# Altium schematic sheet MohamedAazir_WirelessEMG__version_1.0_PCB__ESP.schdoc
size 276 x 197 mm
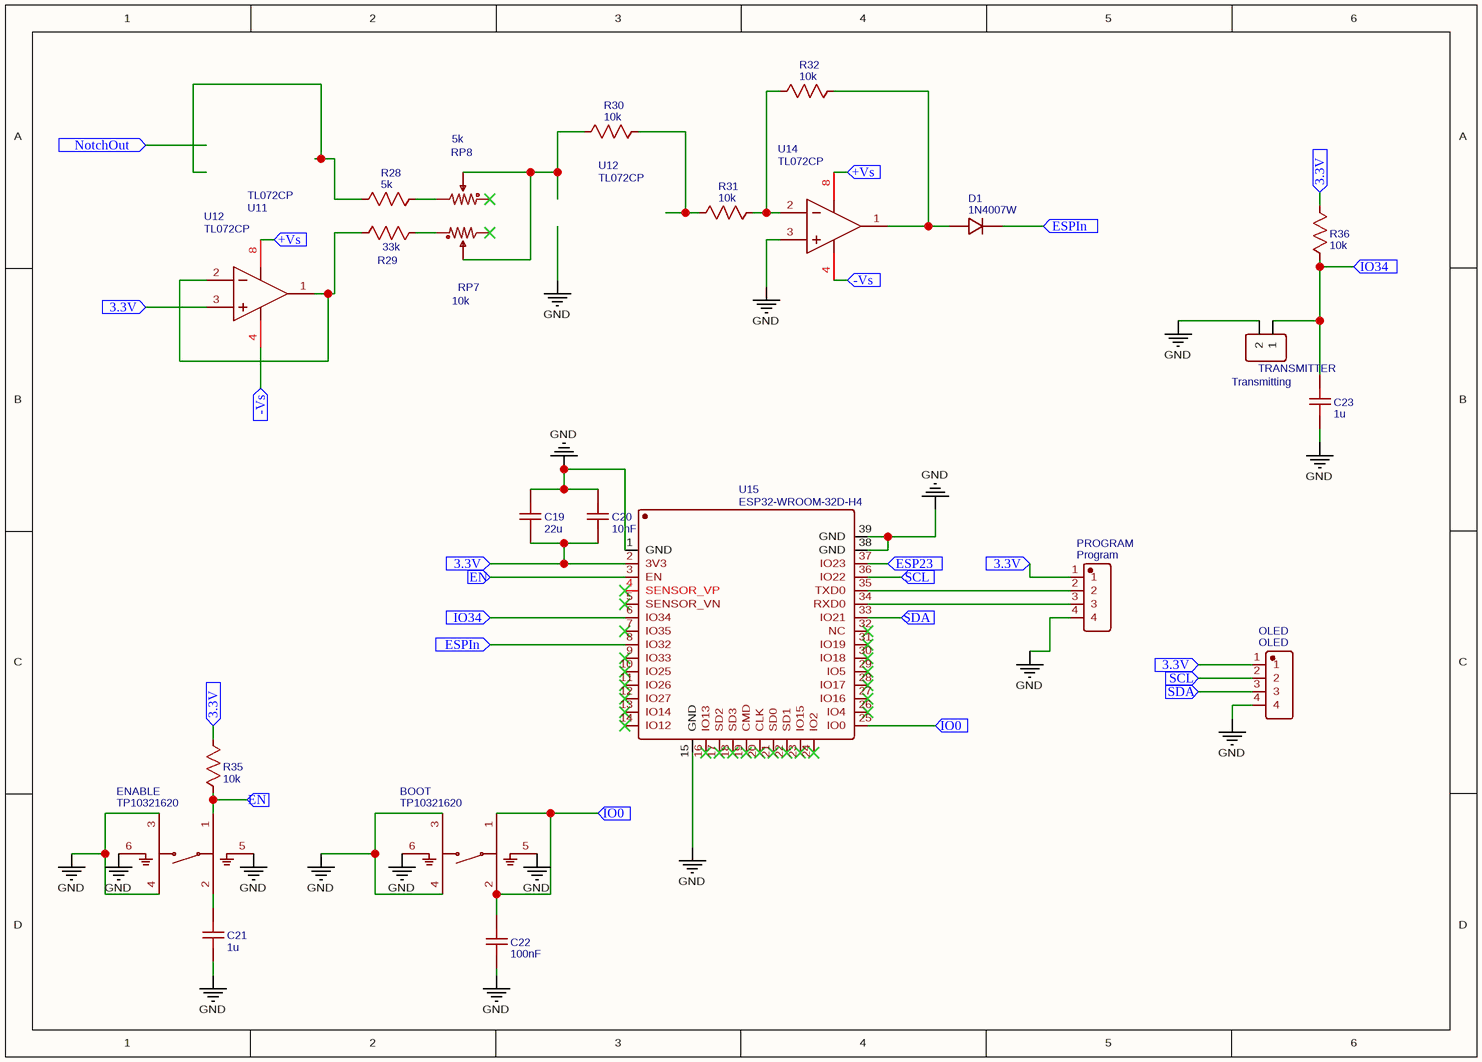
[diagram p0: MohamedAazir_WirelessEMG__version_1.0_PCB__ESP.schdoc]

## Parts
(Parts that share a designator on the sheet are numbered #1, #2 ... from top to bottom, then left to right.)
BOOT  TP10321620  [SW-SMD_ROCPUSWITCHES_TP1032]
C19  22u  [C0603]
C20  10nF  [C0603]
C21  1u  [C0603]
C22  100nF  [C0603]
C23  1u  [C0603]
D1  1N4007W  [SOD-123_L2.8-W1.8-LS3.7-RD]
ENABLE  TP10321620  [SW-SMD_ROCPUSWITCHES_TP1032]
OLED  OLED  [CONN-TH_4P-P4.00_FLY4-HEADER4]
PROGRAM  Program  [CONN-TH_4P-P4.00_FLY4-HEADER4]
R28  5k  [R0603]
R29  33k  [R0603]
R30  10k  [R0603]
R31  10k  [R0603]
R32  10k  [R0603]
R35  10k  [R0603]
R36  10k  [R0603]
RP7  10k  [RES-ADJ-TH_3386P]
RP8  5k  [RES-ADJ-TH_3386P]
TRANSMITTER  Transmitting  [HDR-F-2.54_1X2]
U11  TL072CP  [DIP-8_L9.6-W6.4-P2.54-LS7.6-BL-1]
U12#1  TL072CP  [DIP-8_L9.6-W6.4-P2.54-LS7.6-BL-1]
U12#2  TL072CP  [DIP-8_L9.6-W6.4-P2.54-LS7.6-BL-1]
U14  TL072CP  [DIP-8_L9.6-W6.4-P2.54-LS7.6-BL-1]
U15  ESP32-WROOM-32D-H4  [WIFIM-SMD_ESP32-WROOM-32D]

## Ports
3.3V (in), +Vs (in), -Vs (in), EN (in), ESP23 (in), ESPIn (in), IO0 (in), IO34 (in), NotchOut (in), SCL (in), SDA (in)

## Nets
GND: BOOT.3 BOOT.4 BOOT.5 BOOT.6 C19.1 C20.1 C21.1 C22.1 C23.1 ENABLE.3 ENABLE.4 ENABLE.5 ENABLE.6 OLED.4 PROGRAM.4 TRANSMITTER.2 U14.3(IN1+) U15.1(GND) U15.15(GND) U15.38(GND) U15.39(GND)
3.3V: C19.2 C20.2 OLED.1 PROGRAM.1 R35.2 R36.2 U12#2.3(IN1+) U15.2(3V3) ; port 3.3V
+Vs: U12#2.8(VCC+) U14.8(VCC+) ; port +Vs
-Vs: U12#2.4(VCC-) U14.4(VCC-) ; port -Vs
EN: ENABLE.1 R35.1 U15.3(EN) ; port EN
ESP23: U15.37(IO23) ; port ESP23
ESPIn: D1.1 U15.8(IO32) ; port ESPIn
IO0: BOOT.1 BOOT.2 C22.2 U15.25(IO0) ; port IO0
IO34: C23.2 R36.1 TRANSMITTER.1 U15.6(IO34) ; port IO34
SCL: OLED.2 U15.36(IO22) ; port SCL
SDA: OLED.3 U15.33(IO21) ; port SDA
NetC21_2: C21.2 ENABLE.2
NetD1_2: D1.2 R32.2 U14.1(OUT1)
NetPROGRAM_2: PROGRAM.2 U15.35(TXD0)
NetPROGRAM_3: PROGRAM.3 U15.34(RXD0)
NetR28_2: R28.2 RP7.3
NetR29_1: R29.1 U12#2.1(OUT1) U12#2.2(IN1-)
NetR29_2: R29.2 RP8.1
NetR30_1: R30.1 RP7.2 RP8.2
NetR30_2: R30.2 R31.1
NetR31_2: R31.2 R32.1 U14.2(IN1-)

Not connected (* = marked no-connect by the designer): R28 1; RP7 1*; RP8 3*; U15 4(SENSOR_VP)* 5(SENSOR_VN)* 7(IO35)* 9(IO33)* 10(IO25)* 11(IO26)* 12(IO27)* 13(IO14)* 14(IO12)* 16(IO13)* 17(SD2)* 18(SD3)* 19(CMD)* 20(CLK)* 21(SD0)* 22(SD1)* 23(IO15)* 24(IO2)* 26(IO4)* 27(IO16)* 28(IO17)* 29(IO5)* 30(IO18)* 31(IO19)* 32(NC)*

## Library data of the parts
BOOT ENABLE = TP10321620: Manufacturer: ROCPU Switches(台普); Contributor: lcsc; Supplier: LCSC; Supplier Part: C2999324; Manufacturer Part: TP10321620; JLCPCB Part Class: Extended Part; spicePre: U; spiceSymbolName: TP10321620
C19 = 22u: Manufacturer Part: 1206X226M250NT; Manufacturer: FH(风华); nameAlias: Value(F); Contributor: LCEDA_Lib; Supplier Part: C2858005; Supplier: LCSC; spicePre: C; spiceSymbolName: C_0603_US
C20 = 10nF: Manufacturer Part: C1608X8R1H103M080AA; Manufacturer: TDK; nameAlias: Value(F); Contributor: LCEDA_Lib; Supplier Part: C3901732; Supplier: LCSC; spicePre: C; spiceSymbolName: C_0603_US
C21 C23 = 1u: Manufacturer Part: T491B105M035AT; Manufacturer: KEMET(基美); nameAlias: Value(F); Contributor: LCEDA_Lib; Supplier Part: C600504; Supplier: LCSC; spicePre: C; spiceSymbolName: C_0603_US
C22 = 100nF: Manufacturer Part: CA45-A-35V-0.1UF-K; Manufacturer: CEC(振华新云); nameAlias: Value(F); Contributor: LCEDA_Lib; Supplier Part: C2976900; Supplier: LCSC; spicePre: C; spiceSymbolName: C_0603_US
D1 = 1N4007W: Manufacturer: BLUE ROCKET; Contributor: LCEDA_Lib; Supplier: LCSC; Supplier Part: C328592; Manufacturer Part: 1N4007W; spicePre: D; spiceSymbolName: 1N4007W
OLED = OLED: Manufacturer Part: FLY4-Header4; Contributor: LCSC; Supplier: LCSC; Supplier Part: C9900006105; JLCPCB Part Class: Extended Part; spicePre: C; spiceSymbolName: FLY4-HEADER4
PROGRAM = Program: Manufacturer Part: FLY4-Header4; Contributor: LCSC; Supplier: LCSC; Supplier Part: C9900006105; JLCPCB Part Class: Extended Part; spicePre: C; spiceSymbolName: FLY4-HEADER4
R28 = 5k: Manufacturer Part: TR0603B5K00P0525Z; Manufacturer: EVER OHMS(天二科技); nameAlias: Value(Ω); Contributor: LCEDA_Lib; Supplier Part: C3202451; Supplier: LCSC; spicePre: R; spiceSymbolName: R_0603_US
R29 = 33k: Manufacturer Part: MEV07V3302FE; Manufacturer: Ohmite; nameAlias: Value(Ω); Contributor: LCEDA_Lib; Supplier Part: C4216305; Supplier: LCSC; spicePre: R; spiceSymbolName: R_0603_US
R30-R32 R35 R36 = 10k: Manufacturer Part: CSR0204FTDV1002; Manufacturer: Viking(光颉); nameAlias: Value(Ω); Contributor: LCEDA_Lib; Supplier Part: C316475; Supplier: LCSC; spicePre: R; spiceSymbolName: R_0603_US
RP7 = 10k: Manufacturer Part: ST-4ETG 10K OHM (103); Manufacturer: NIDEC(尼得科); nameAlias: Value; Contributor: LCEDA_Lib; Supplier Part: C132882; Supplier: LCSC; value(Ω): 10K; spicePre: R; spiceSymbolName: R_3386P_US
RP8 = 5k: Manufacturer Part: VG039NCHXTB502; Manufacturer: HDK(北陆电气); nameAlias: Value; Contributor: LCEDA_Lib; value(Ω): 10K; Supplier Part: C128557; Supplier: LCSC; spicePre: R; spiceSymbolName: R_3386P_US
TRANSMITTER = Transmitting: Contributor: LCEDA_Lib; Supplier Part: C49661; Supplier: LCSC; spicePre: H; spiceSymbolName: HDR-F-2.54_1x2
U11 U12#1 U12#2 U14 = TL072CP: subpart_no: 1; Manufacturer: TI(德州仪器); tags: FET Operational Amplifier; Supplier Part: C7236; Supplier: LCSC; Manufacturer Part: TL072CP; JLCPCB Part Class: Extended Part; spicePre: U; spiceSymbolName: TL072CP
U15 = ESP32-WROOM-32D-H4: Manufacturer: ESPRESSIF(乐鑫); Contributor: lcsc; Supplier: LCSC; Supplier Part: C3013936; Manufacturer Part: ESP32-WROOM-32D-H4; JLCPCB Part Class: Extended Part; spicePre: U; spiceSymbolName: ESP32-WROOM-32D-H4